# Altium schematic sheet Power.SchDoc
size A4
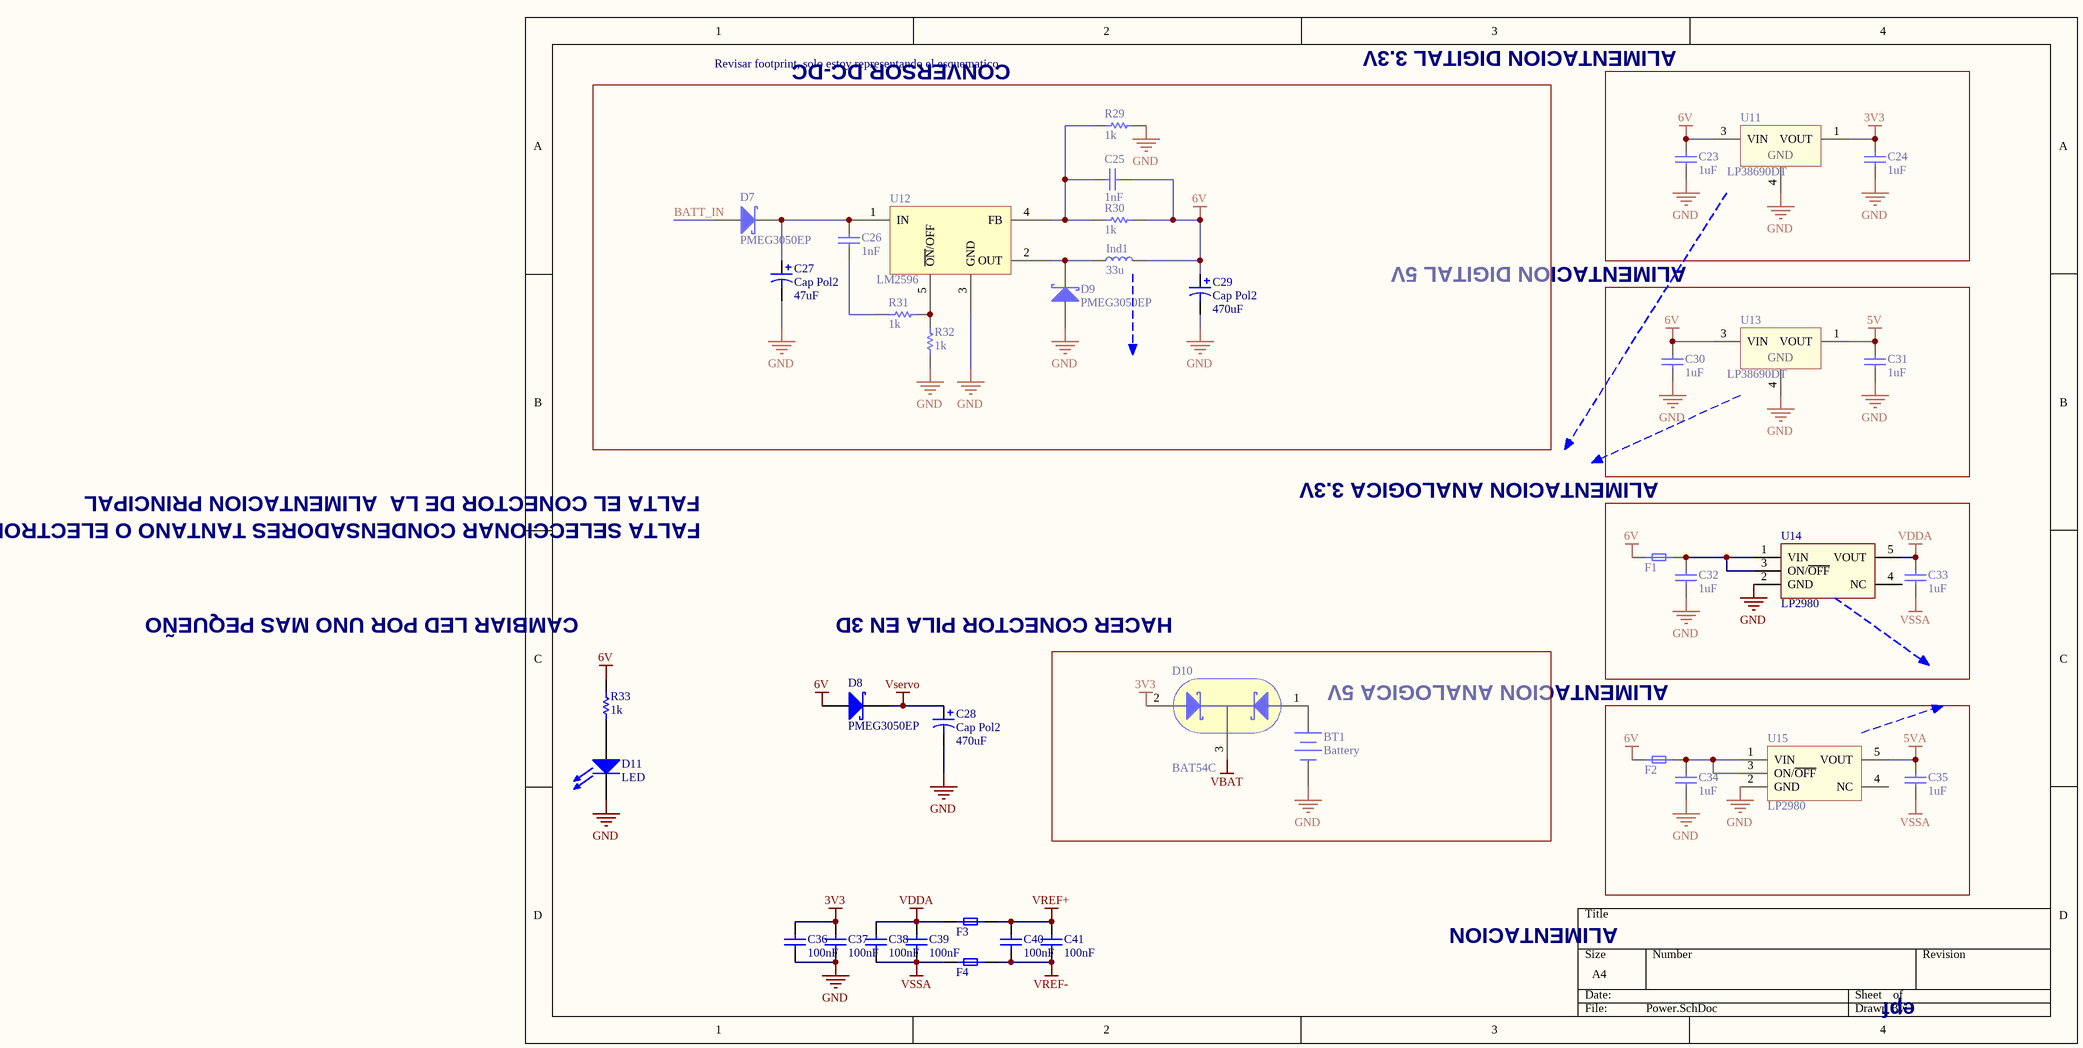
[diagram p0: Power.SchDoc]

## Parts
BT1  Battery  [BC501SM]
C23  value 1uF  [0805_CAP]  (hidden comment: Capacitor)
C24  value 1uF  [0805_CAP]  (hidden comment: Capacitor)
C25  value 1nF  [0805_CAP]  (hidden comment: Capacitor)
C26  value 1nF  [0805_CAP]  (hidden comment: Capacitor)
C27  Cap Pol2  value 47uF  [TC7360-2924]
C28  Cap Pol2  value 470uF  [TC7360-2924]
C29  Cap Pol2  value 470uF  [TC7360-2924]
C30  value 1uF  [0805_CAP]  (hidden comment: Capacitor)
C31  value 1uF  [0805_CAP]  (hidden comment: Capacitor)
C32  value 1uF  [CAP0402]  (hidden comment: Capacitor)
C33  value 1uF  [CAP0402]  (hidden comment: Capacitor)
C34  value 1uF  [CAP0402]  (hidden comment: Capacitor)
C35  value 1uF  [CAP0402]  (hidden comment: Capacitor)
C36  value 100nF  [CAP0402]  (hidden comment: Capacitor)
C37  value 100nF  [CAP0402]  (hidden comment: Capacitor)
C38  value 100nF  [CAP0402]  (hidden comment: Capacitor)
C39  value 100nF  [CAP0402]  (hidden comment: Capacitor)
C40  value 100nF  [CAP0402]  (hidden comment: Capacitor)
C41  value 100nF  [CAP0402]  (hidden comment: Capacitor)
D7  PMEG3050EP  [SOD128]
D8  PMEG3050EP  [SOD128]
D9  PMEG3050EP  [SOD128]
D10  BAT54C  [SOT23]
D11  LED  [PLCC-2Rojo]
F1  Ferrita  [IND0603]  (value not drawn)
F2  Ferrita  [IND0603]  (value not drawn)
F3  Ferrita  [IND0603]  (value not drawn)
F4  Ferrita  [IND0603]  (value not drawn)
Ind1  Valor: 33u  [CDRH127]  (hidden comment: Ind2)
R29  value 1k  [0805_RES]  (hidden comment: Resistor)
R30  value 1k  [0805_RES]  (hidden comment: Resistor)
R31  value 1k  [0805_RES]  (hidden comment: Resistor)
R32  value 1k  [0805_RES]  (hidden comment: Resistor)
R33  value 1k  [RES0402]  (hidden comment: Resistor)
U11  LP38690DT  [TO252-3N]
U12  LM2596  [TO-263 - LM2596]
U13  LP38690DT  [TO252-3N]
U14  LP2980  [SOT23-5BN]
U15  LP2980  [SOT23-5BN]

## Blocks framed on the sheet
Revisar footprint, solo estoy representando el esquematico: C25-C27 C29 D7 D9 Ind1 R29-R32 U12
ALIMENTACION DIGITAL 5V: C23 C24 U11
ALIMENTACION ANALOGICA 3.3V: C30 C31 U13
ALIMENTACION ANALOGICA 5V: C32 C33 F1 U14

## Nets
3V3: C24.2 C36.2 C37.2 D10.2(NC) U11.1(VOUT)
5V: C31.2 U13.1(VOUT)
5VA: C35.2 U15.5(VOUT)
6V: C23.2 C25.1 C29.1 C30.2 D8.2(A) F1.1 F2.1 Ind1.2 R30.2 R33.1 U11.3(VIN) U13.3(VIN)
GND: BT1.2(-) C23.1 C24.1 C27.2 C28.2 C29.2 C30.1 C31.1 C32.1 C34.1 C36.1 C37.1 D9.2(A) D11.2(K) R29.2 R32.1 U11.4(GND) U12.3(GND) U13.4(GND) U14.2(GND) U15.2(GND)
VBAT: D10.3(K)
VDDA: C33.2 C38.2 C39.2 F3.1 U14.5(VOUT)
VREF+: C40.2 C41.2 F3.2
VREF-: C40.1 C41.1 F4.2
Vservo: C28.1 D8.1(K)
VSSA: C33.1 C35.1 C38.1 C39.1 F4.1
BATT_IN: D7.2(A)
NetBT1_1: BT1.1(+) D10.1(A)
NetC25_2: C25.2 R29.1 R30.1 U12.4(FB)
NetC26_1: C26.1 R31.1
NetC26_2: C26.2 C27.1 D7.1(K) U12.1(IN)
NetC32_2: C32.2 F1.2 U14.1(VIN) U14.3(ON/~{OFF})
NetC34_2: C34.2 F2.2 U15.1(VIN) U15.3(ON/~{OFF})
NetD9_1: D9.1(K) Ind1.1 U12.2(OUT)
NetD11_1: D11.1(A) R33.2
NetR31_2: R31.2 R32.2 U12.5(~{ON}/OFF)

Not connected (* = marked no-connect by the designer): U14 4(NC); U15 4(NC)

## Notes on the sheet
- (near R29) CONVERSOR DC-DC
- ALIMENTACION DIGITAL 3.3V
- FALTA SELECCIONAR CONDENSADORES TANTANO O ELECTROLITICOS
- FALTA EL CONECTOR DE LA  ALIMENTACION PRINCIPAL
- CAMBIAR LED POR UNO MAS PEQUEÑO
- HACER CONECTOR PILA EN 3D
- ALIMENTACION
- epf

## Library data of the parts
BT1 = Battery: Multicell Battery; Published: 24-Mar-1999; LatestRevisionDate: 17-Jul-2002; LatestRevisionNote: Re-released for DXP Platform.; PackageReference: BAT-2; Publisher: Altium Limited
C23-C26 C30-C41 = Cap
C27-C29 = Cap Pol2: Polarized Capacitor (Axial); Published: 8-Jun-2000; LatestRevisionDate: 17-Jul-2002; LatestRevisionNote: Re-released for DXP Platform.; PackageReference: POLAR0.8; Publisher: Altium Limited
D7-D9 = PMEG3050EP: DIODO 5A DC-DC
D10 = BAT54C: Single schottky
D11 = LED1
R29-R33 = Res
U11 U13 = LP38690DT: Current 1A
U14 U15 = LP2980: Current 50mA